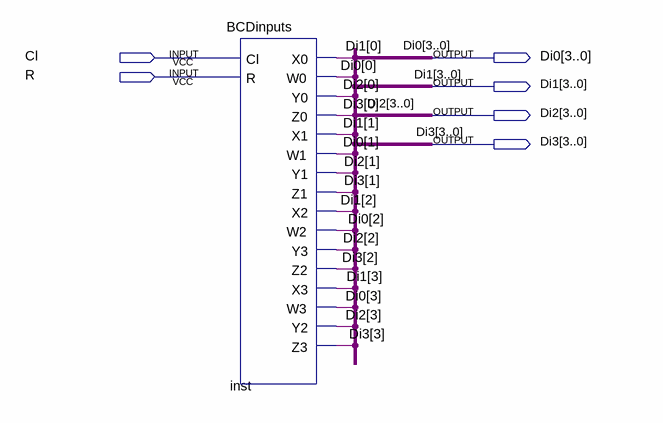
[diagram p0: schematic sheet]
// Quartus schematic BCDClockedCounterBus.bdf as structural Verilog: 1 symbols, 6 pins
module BCDClockedCounterBus (
  input  Cl,
  input  R,
  output [3:0] Di0,
  output [3:0] Di1,
  output [3:0] Di2,
  output [3:0] Di3
);

  BCDinputs inst (
    .Cl(Cl), .R(R), .X0(Di1[0]), .W0(Di0[0]), .Y0(Di2[0]), .Z0(Di3[0]), .X1(Di1[1]), .W1(Di0[1]),
    .Y1(Di2[1]), .Z1(Di3[1]), .X2(Di1[2]), .W2(Di0[2]), .Y3(Di2[2]), .Z2(Di3[2]), .X3(Di1[3]), .W3(Di0[3]),
    .Y2(Di2[3]), .Z3(Di3[3]));
endmodule
